# Altium schematic sheet ad26-dblib-placed.SchDoc
size A
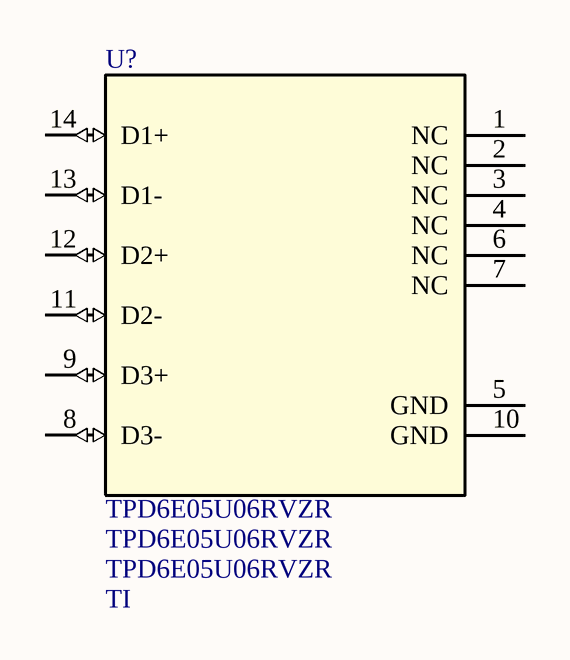
[diagram p0: ad26-dblib-placed.SchDoc]

## Parts
U?  TPD6E05U06RVZR  Manufacturer: TI  [RVZ0014A]

## Nets

Not connected (* = marked no-connect by the designer): U? 1(NC) 2(NC) 3(NC) 4(NC) 5(GND) 6(NC) 7(NC) 8(D3-) 9(D3+) 10(GND) 11(D2-) 12(D2+) 13(D1-) 14(D1+)

## Library data of the parts
U? = TPD6E05U06RVZR: 14VC Clamp 2.5A@8/20us Ipp ESD DIODE USON-14(1.4x3.5); Manufacturer_Name: Texas Instruments; TYPE: TYPE; RefDes: RefDes; Copyright: Copyright (C) 2025 Ultra Librarian. All rights reserved.; Manufacturer_Part_Number: TPD6E05U06RVZR; MPN: TPD6E05U06RVZR; Value: TPD6E05U06RVZR; ComponentLink1Description: Datasheet; ComponentLink1URL: https://datasheet.lcsc.com/datasheet/pdf/a477ce77ef5dfe176ca5c7d3f762e256.pdf?productCode=C962978; Supplier: LCSC; SupplierPartNumber: C962978; SupplierURL: https://www.lcsc.com/product-detail/C962978.html; Price: 0.0980; Stock: 2810; Lifecycle: Active; Category: Other; Stockroom ID: tpd6e05u06rvzr